# EAGLE schematic Works_004 (EAGLE 8.2.1)
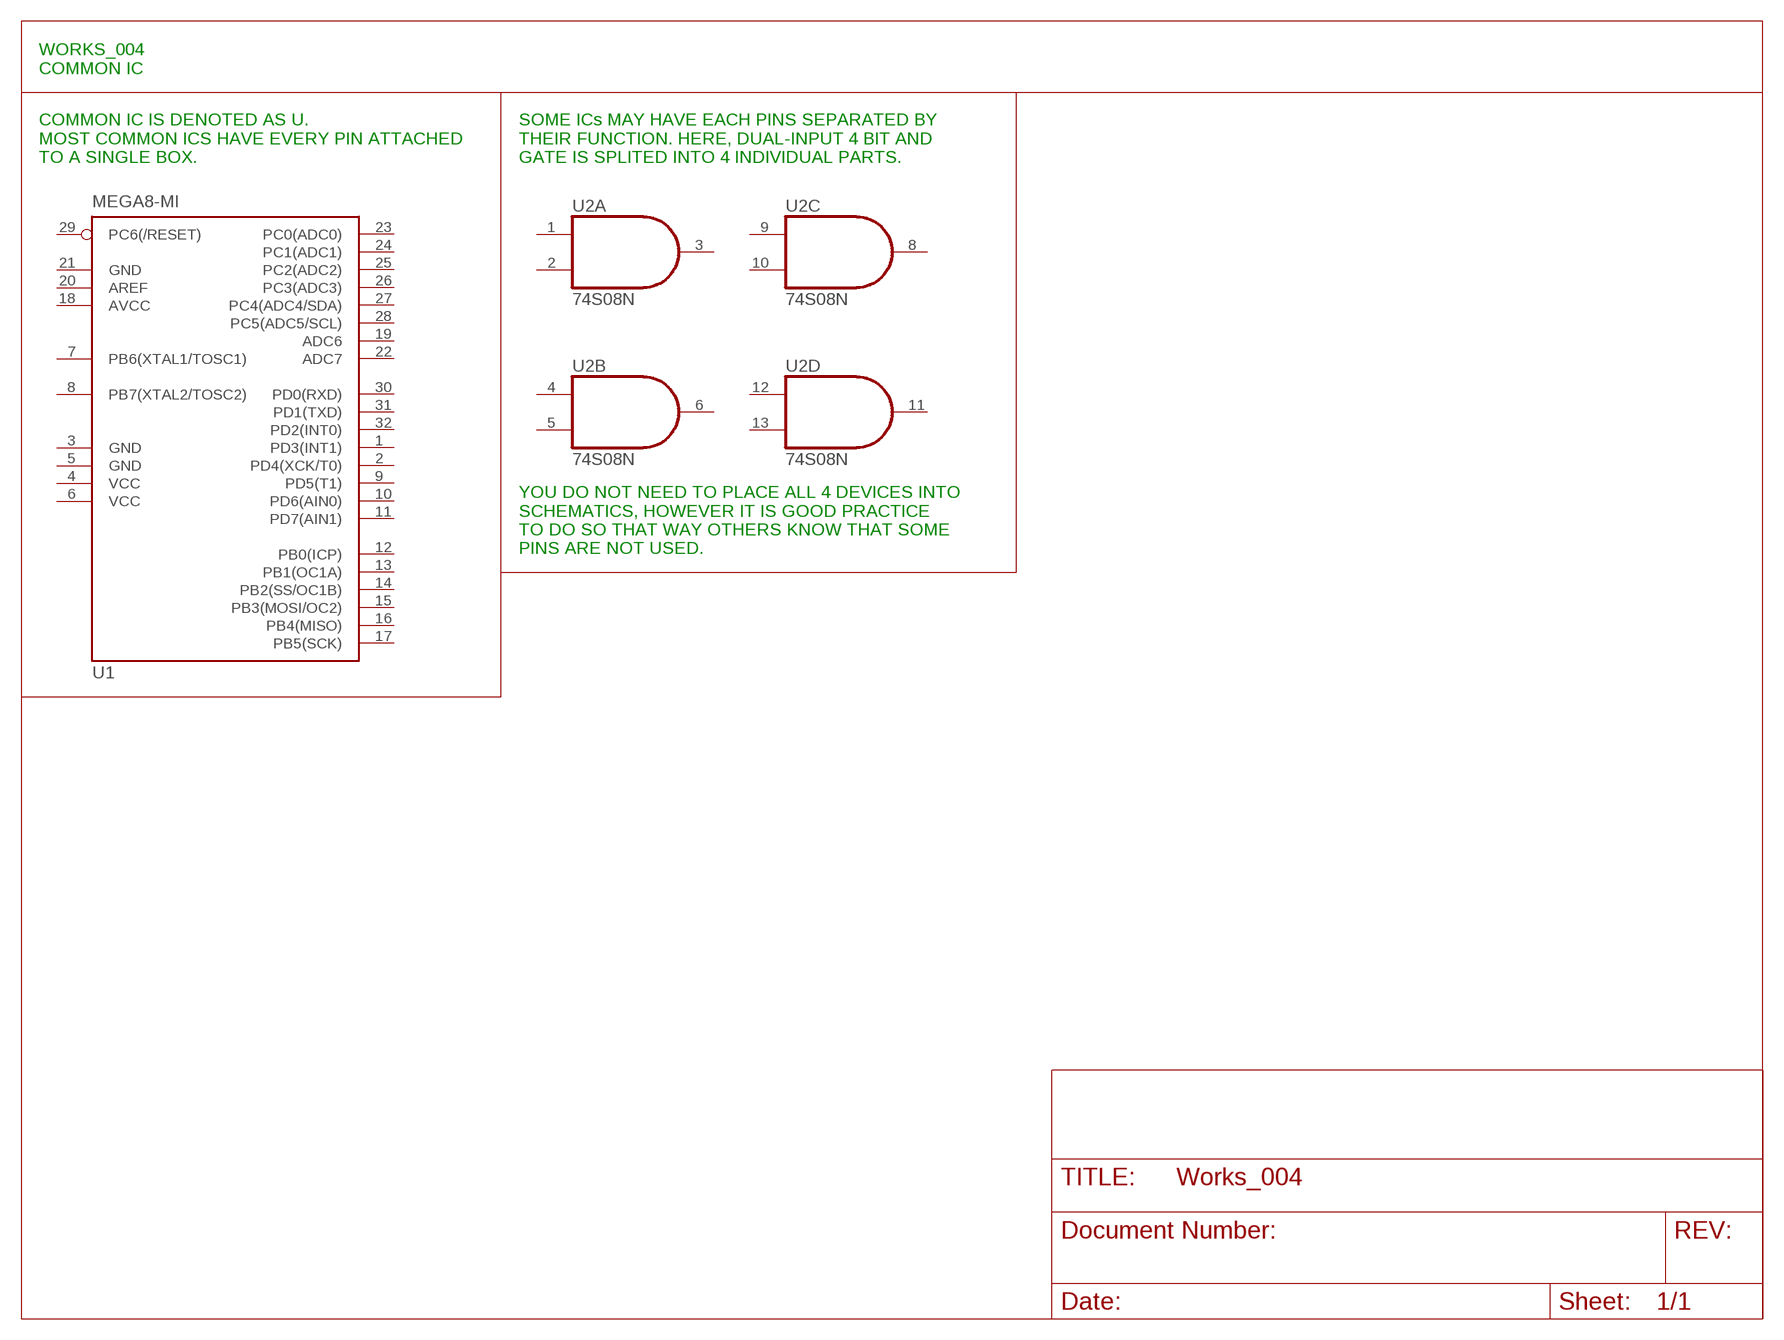
[diagram p0: schematic, sheet 1]

## Parts
U1  MEGA8-MI  [MLF32]
U2  74S08N  [DIL14]
Unconnected: U1.1(PD3(INT1)) U1.2(PD4(XCK/T0)) U1.7(PB6(XTAL1/TOSC1)) U1.8(PB7(XTAL2/TOSC2)) U1.9(PD5(T1)) U1.10(PD6(AIN0)) U1.11(PD7(AIN1)) U1.12(PB0(ICP)) U1.13(PB1(OC1A)) U1.14(PB2(SS/OC1B)) U1.15(PB3(MOSI/OC2)) U1.16(PB4(MISO)) U1.17(PB5(SCK)) U1.19(ADC6) U1.20(AREF) U1.22(ADC7) U1.23(PC0(ADC0)) U1.24(PC1(ADC1)) U1.25(PC2(ADC2)) U1.26(PC3(ADC3)) U1.27(PC4(ADC4/SDA)) U1.28(PC5(ADC5/SCL)) U1.29(PC6(/RESET)) U1.30(PD0(RXD)) U1.31(PD1(TXD)) U1.32(PD2(INT0)) U2.1(A:I0) U2.2(A:I1) U2.3(A:O) U2.4(B:I0) U2.5(B:I1) U2.6(B:O) U2.8(C:O) U2.9(C:I0) U2.10(C:I1) U2.11(D:O) U2.12(D:I0) U2.13(D:I1)

## Notes on the sheet
- WORKS_004
  COMMON IC
- COMMON IC IS DENOTED AS U.
  MOST COMMON ICS HAVE EVERY PIN ATTACHED
  TO A SINGLE BOX.
- SOME ICs MAY HAVE EACH PINS SEPARATED BY
  THEIR FUNCTION. HERE, DUAL-INPUT 4 BIT AND
  GATE IS SPLITED INTO 4 INDIVIDUAL PARTS.
- YOU DO NOT NEED TO PLACE ALL 4 DEVICES INTO
  SCHEMATICS, HOWEVER IT IS GOOD PRACTICE
  TO DO SO THAT WAY OTHERS KNOW THAT SOME
  PINS ARE NOT USED.

## Power pins joined to a net without a drawn wire
AVCC: U1.18(AVCC)
GND: U1.3(GND) U1.5(GND) U1.21(GND) U2.7(P:GND)
VCC: U1.4(VCC) U1.6(VCC) U2.14(P:VCC)

## Library data of the parts
U1 = atmel:MEGA8: MICROCONTROLLER 8 Kbytes FLASH, 1 kbytes SRAM, 512 bytes EEPROM, USART, 6-channel 10 bit ADC, 2-channel 8 bit ADC Pin compatible with Atmega48, ATMega88, ATMega168 Source: avr.lbr; MPN: ATMEGA88PA-MU; OC_FARNELL: 1715491; OC_NEWARK: 15R0272
U2 = 74xx-us:74*08: Quad 2-input AND gate